# EAGLE design iBuff_Gimp (EAGLE 9.6.2)
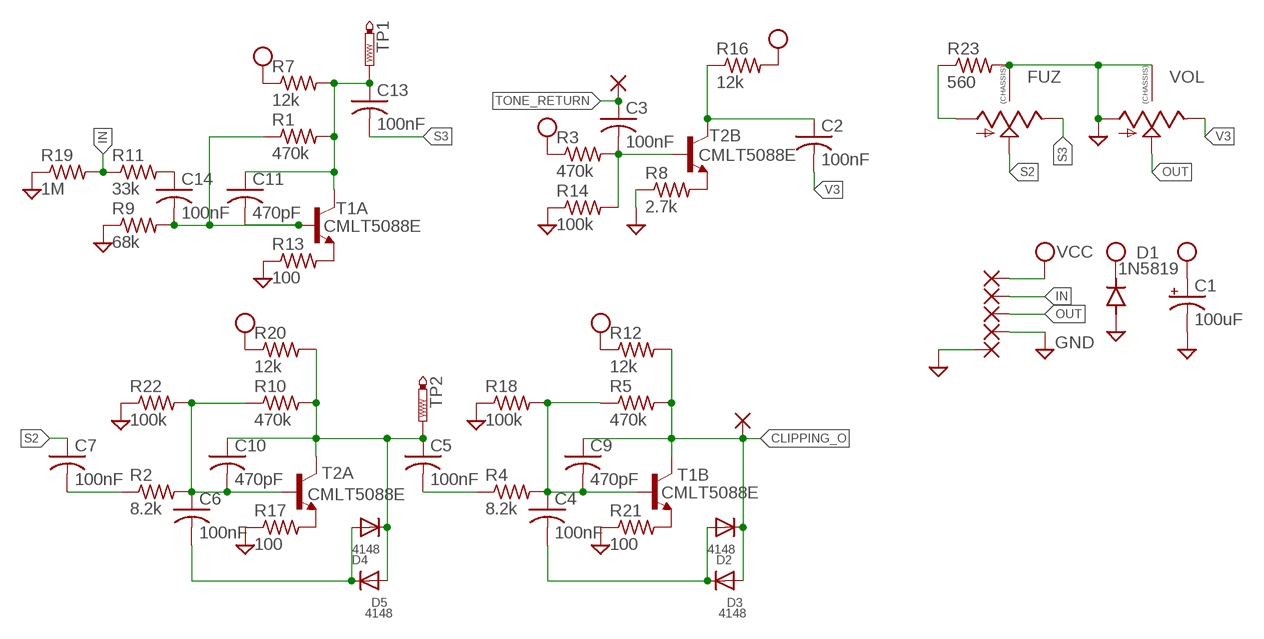
[diagram p0: schematic, sheet 1]

## Parts
C1  100uF  100UF-POLAR-RADIAL-2.5MM-25V-20%  [CPOL-RADIAL-2.5MM-6.5MM]
C2  100nF  C-USC0603  [C0603]
C3  100nF  C-USC0603  [C0603]
C4  100nF  C-USC0603  [C0603]
C5  100nF  C-USC0603  [C0603]
C6  100nF  C-USC0603  [C0603]
C7  100nF  C-USC0603  [C0603]
C9  470pF  C-USC0603  [C0603]
C10  470pF  C-USC0603  [C0603]
C11  470pF  C-USC0603  [C0603]
C13  100nF  C-USC0603  [C0603]
C14  100nF  C-USC0603  [C0603]
D1  1N5819  DIODE-SOD123  [SOD123]
D2  4148  DIODESOD-123  [SOD-123]
D3  4148  DIODESOD-123  [SOD-123]
D4  4148  DIODESOD-123  [SOD-123]
D5  4148  DIODESOD-123  [SOD-123]
FUZ  9MM_SNAP-IN_POT_CHASSIS  [9MM_SNAP-IN_POT]
PAD1  1,6/0,8  [1,6/0,8]
PAD2  1,6/0,8  [1,6/0,8]
PAD3  1,6/0,8  [1,6/0,8]
PAD4  1,6/0,8  [1,6/0,8]
PAD5  1,6/0,8  [1,6/0,8]
PAD6  1,6/0,8  [1,6/0,8]
PAD7  1,6/0,8  [1,6/0,8]
R1  470k  R-US_R0603  [R0603]
R2  8.2k  R-US_R0603  [R0603]
R3  470k  R-US_R0603  [R0603]
R4  8.2k  R-US_R0603  [R0603]
R5  470k  R-US_R0603  [R0603]
R7  12k  R-US_R0603  [R0603]
R8  2.7k  R-US_R0603  [R0603]
R9  68k  R-US_R0603  [R0603]
R10  470k  R-US_R0603  [R0603]
R11  33k  R-US_R0603  [R0603]
R12  12k  R-US_R0603  [R0603]
R13  100  R-US_R0603  [R0603]
R14  100k  R-US_R0603  [R0603]
R16  12k  R-US_R0603  [R0603]
R17  100  R-US_R0603  [R0603]
R18  100k  R-US_R0603  [R0603]
R19  1M  R-US_R0603  [R0603]
R20  12k  R-US_R0603  [R0603]
R21  100  R-US_R0603  [R0603]
R22  100k  R-US_R0603  [R0603]
R23  560  R-US_R0603  [R0603]
T1  CMLT5088E  [SOT563]
T2  CMLT5088E  [SOT563]
TP1  PTR1TP08R  [TP08R]
TP2  PTR1TP08R  [TP08R]
VOL  9MM_SNAP-IN_POT_CHASSIS  [9MM_SNAP-IN_POT]

## Nets
CLIPPING_O: C9.1 D2.C D3.A PAD5.1(P) R5.2 R12.2 T1.3(B:C)
GND: C1.2(-) D1.A FUZ.CHASSIS1 FUZ.CHASSIS2 PAD4.1(P) PAD7.1(P) R8.1 R9.1 R13.1 R14.1 R17.1 R18.1 R19.1 R21.1 R22.1 R23.2 VOL.1(A) VOL.CHASSIS1 VOL.CHASSIS2
IN: PAD2.1(P) R11.1 R19.2
N$1: FUZ.1(A) R23.1
N$2: C11.2 C14.2 R1.1 R9.2 T1.2(A:B)
N$3: C14.1 R11.2
N$4: R13.2 T1.1(A:E)
N$5: C11.1 C13.1 R1.2 R7.2 T1.6(A:C) TP1.TP
N$6: C7.2 R2.1
N$7: C6.1 C10.2 R2.2 R10.1 R22.2 T2.2(A:B)
N$8: C5.1 C10.1 D4.C D5.A R10.2 R20.2 T2.6(A:C) TP2.TP
N$9: R17.2 T2.1(A:E)
N$10: C6.2 D4.A D5.C
N$11: C5.2 R4.1
N$12: R21.2 T1.4(B:E)
N$13: C4.1 C9.2 R4.2 R5.1 R18.2 T1.5(B:B)
N$14: C3.2 R3.2 R14.2 T2.5(B:B)
N$15: C4.2 D2.A D3.C
N$16: R8.2 T2.4(B:E)
N$17: C2.1 R16.1 T2.3(B:C)
OUT: PAD3.1(P) VOL.2(S)
S2: C7.1 FUZ.2(S)
S3: C13.2 FUZ.3(E)
TONE_RETURN: C3.1 PAD6.1(P)
V3: C2.2 VOL.3(E)
VCC: C1.1(+) D1.C PAD1.1(P) R3.1 R7.1 R12.1 R16.2 R20.1

## Library data of the parts
C1 = SparkFun-Capacitors:100UF-POLAR: 100µF polarized capacitors A capacitor is a passive two-terminal electrical component used to store electrical energy temporarily in an electric field.; PROD_ID: CAP-08439
C2-C7 C9-C11 C13 C14 = adafruit:C-US: CAPACITOR, American symbol
D1 = diode:DIODE-: DIODE
D2-D5 = adafruit:DIODE: Diode SMADIODE - SMA Surface Mount Package 20V 1A Schottky Diode Digikey: 641-1014-6-ND DO-1N4148 - Through Hole Small Current Diode SOD-123 20V 1 A (.5mV Vf) Schottky Diode - Digikey: MBRX120TPMSCT-ND SOD-323 10V 570mA (.38mV Vf, 3ns) Schottky Diode - Digikey: ZLLS410CT-ND SOD-523 30V 30mA Schottky Diode (RB751S-40TE61) - Digikey: RB751S-40TE61CT-ND SOT23-R/W - SOT23 Package (R = Solder Paste/Reflow Ovens, W = Hand-Soldering) BAT54Film 40V 300mA - Digikey: 497-7162-1-ND
FUZ VOL = MusicThingModular:9MM_SNAP-IN_POT_CHASSIS: 9mm vertical snap-in pot, Alpha / Panasonic style, with a connection to the metal chassis for grounding
PAD1-PAD7 = wirepad:1,6/0,8: THROUGH-HOLE PAD
R1-R5 R7-R14 R16-R23 = adafruit:R-US_: RESISTOR, American symbol
T1 T2 = transistor-neu-to92:CMLT5088E: DUAL NPN/NPN L88 TRANSISTORS ENHANCED SPECIFICATION PICOmini(TM) SURFACE MOUNT Source: CMLT5078%20SERIES.pdf
TP1 TP2 = testpad:PTR1: TEST PIN

## Board
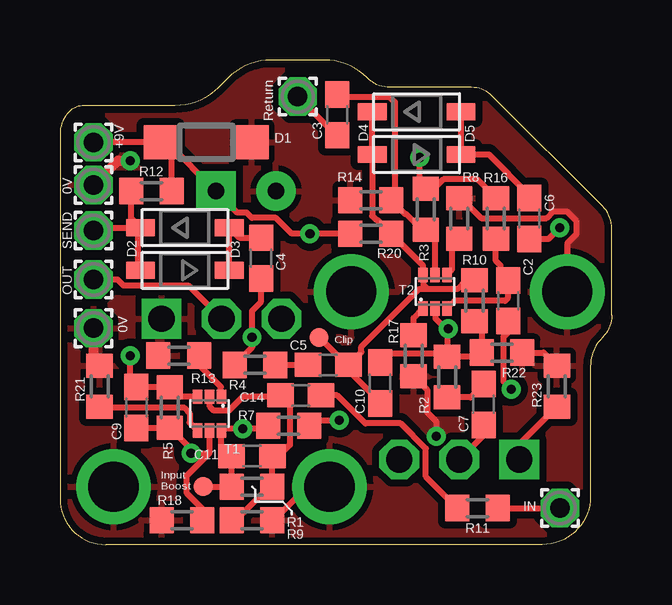
[diagram p1: board, top side]
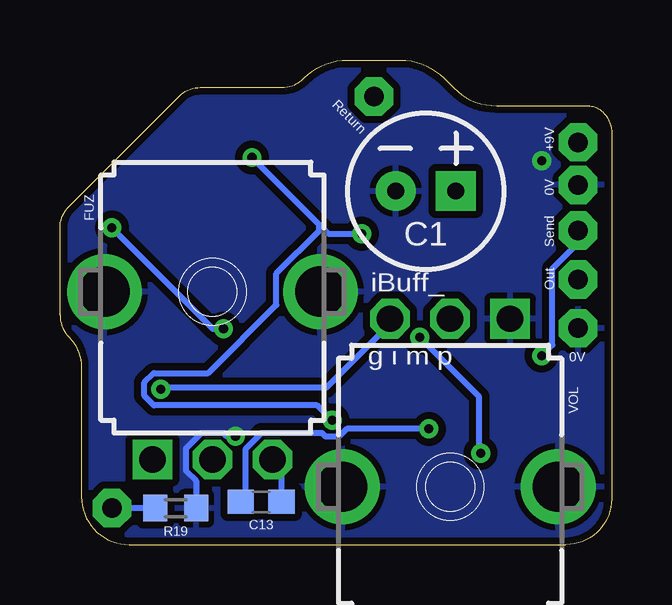
[diagram p2: board, bottom side, seen from below]

Size 22.99 x 20.19 mm. Coordinates in mm from the lower left corner, seen from the top.
Outline: 0,15.75 0,1.91 arc90 1.91,0 20.1,0 arc90 22.1,2 22.1,7.41 arc-45 22.61,8.64 arc45 22.99,9.56 22.99,13.18 arc45 22.61,14.1 18.01,18.69 arc45 17.14,19.05 13.75,19.05 arc-45 12.83,19.43 12.81,19.45 arc45 11.01,20.19 8.8,20.19 arc45 7,19.45 6.59,19.03 arc-45 4.79,18.29 0.99,18.29 arc45 0.38,18.03 arc45 0,17.11 0,15.75
Copper layers (1*16): Top 0.035mm / dielectric 1.5mm / Bottom 0.035mm
Design rules "default *": minimum track width 6mil, minimum drill 0.35mm, track to track 6mil, track to pad 6mil, pad to pad 6mil, via to via 6mil, smd to smd 6mil, copper to edge 10mil, drill to drill 6mil, minimum pad ring 10mil, minimum via ring 8mil, stop-mask expansion 4mil, vias tented up to drill 0mil, thermal gap 10mil

### Footprints (pad centres in the part's own frame; a part is rotated, then mirrored left to right if it is on the bottom)
CPOL-RADIAL-2.5MM-6.5MM = drill 0.7 pad 1.651 square: 1 1.25,0 | drill 0.7 pad 1.651: 2 -1.25,0
C0603 = smd 1.1 x 1: 1 -0.85,0; 2 0.85,0
SOD123 = smd 1.4 x 1.4: A 1.9,0; C -1.9,0
SOD-123 = smd 1.2 x 0.7: A 1.85,0; C -1.85,0
9MM_SNAP-IN_POT = drill 1.1 square: 1 -2.5,-7 | drill 1.1 octagon: 2 0,-7; 3 2.5,-7 | drill 2.1 pad 2.794: CHASSIS1 -4.5,0; CHASSIS2 4.5,0
1,6/0,8 = drill 0.813 pad 1.6 octagon: 1 0,0
R0603 = smd 1 x 1.1: 1 -0.85,0; 2 0.85,0
SOT563 = smd 0.4 x 0.6: 1 -0.5,-0.7; 2 0,-0.7; 3 0.5,-0.7; 4 0.5,0.7; 5 0,0.7; 6 -0.5,0.7
TP08R = smd 0.8 x 0.8: TP 0,0

### Placement (x,y rotation side)
C1  7.75,14.73 0 bottom
C2  18.67,10.16 270 top
C3  11.56,17.91 90 top
C4  8.38,11.94 90 top
C5  11.18,7.49 180 top
C6  19.56,13.59 90 top
C7  17.65,5.84 90 top
C9  3.17,5.71 270 top
C10  13.34,6.73 90 top
C11  8,3.68 0 top
C13  14.61,1.78 0 bottom
C14  10.03,6.22 180 top
D1  6.1,16.76 0 top
D2  5.21,13.21 0 top
D3  5.21,11.43 180 top
D4  14.86,18.03 0 top
D5  14.86,16.26 180 top
FUZ  16.64,10.54 0 bottom
PAD1  1.4,16.76 0 top
PAD2  20.83,1.52 0 top
PAD3  1.4,11.05 0 top
PAD4  1.4,9.02 0 top
PAD5  1.4,13.08 0 top
PAD6  9.91,18.67 0 top
PAD7  1.4,14.99 0 top
R1  8,2.41 180 top
R2  16.13,6.99 90 top
R3  15.24,13.97 270 top
R4  8.13,7.49 180 top
R5  4.57,5.71 90 top
R7  9.53,4.95 180 top
R8  16.64,13.59 270 top
R9  8,1.02 180 top
R10  17.27,10.16 90 top
R11  17.4,1.52 180 top
R12  3.81,14.73 180 top
R13  4.95,7.87 0 top
R14  12.95,14.35 0 top
R16  18.16,13.59 90 top
R17  14.73,7.87 90 top
R18  5.08,1.02 0 top
R19  18.16,1.52 180 bottom
R20  12.95,12.95 0 top
R21  1.65,6.6 270 top
R22  18.41,8 180 top
R23  20.7,6.6 90 top
T1  6.22,5.46 180 top
T2  15.62,10.54 0 top
TP1  5.97,2.41 0 top
TP2  10.79,8.64 0 top
VOL  6.73,2.41 180 bottom

### Tracks (layer width: path | path; a pad name or v marks a point on that pad's centre or on a via)
CLIPPING_O  (via drill 0.38)
  Top 0.254: PAD5.1 1.52,13.21 D2.C 3.27,13.3 | 3.27,13.3 2.96,13.61 R12.2 | D3.A 3.27,11.52 3.27,13.3 | T1.3 4.98,6.16 R5.2 C9.1 2.92,6.82 v2.92,7.87
  Bottom 0.254: v2.92,7.87 2.48,8.32 2.48,11.5 1.4,12.58 PAD5.1
GND  (via drill 0.38)
  Top 0.254: R17.1 15.3,6.46 15.3,5.52 15.67,5.14 v15.67,4.52 | R22.1 20.15,8 R23.2 | R9.1 8.9,1.02 10.3,2.41 VOL.CHASSIS2 | R8.1 16.72,14.44 17.55,13.61 20.28,13.61 20.55,13.88 21.11,13.88 21.5,13.49 21.5,12.93 21.14,12.56 FUZ.CHASSIS1
  Top 0.406: PAD7.1 2.41,16 v2.92,16 | R21.1 1.4,7.71 PAD4.1
  Bottom 0.254: R19.1 17.31,2.65 17.74,3.08 17.74,4 17.09,4.64 16.18,4.64 16.05,4.52 v15.67,4.52
  pour Bottom (isolate 0.305): -2.67,24.13 -2.67,-2.54 25.27,-2.54 25.27,24.13
  pour Top (isolate 0.305): -2.67,24.13 -2.67,-2.54 25.27,-2.54 25.27,24.13
IN
  Top 0.254: R11.1 PAD2.1
  Bottom 0.254: R19.2 PAD2.1
N$1
  Top 0.254: FUZ.1 19.14,4.19 R23.1
N$2
  Top 0.254: R9.2 7.33,1.02 8.72,2.41 R1.1 C11.2 9.1,3.68 9.58,4.16 9.58,5.83 C14.2 9.12,6.16 7.62,6.16 7.04,5.58 6.41,5.58 6.24,5.75 6.24,6.14 T1.2
N$3
  Top 0.254: R11.2 15.24,2.83 15.24,4 14.19,5.05 12.72,5.05 11.55,6.22 C14.1
N$4
  Top 0.254: T1.1 6.7,6.18 6.7,6.58 5.8,7.48 R13.2
N$5  (via drill 0.38)
  Top 0.254: R7.2 8.55,4.83 v7.62,4.83 6.72,4.83 T1.6 6.72,4.11 C11.1 R1.2 TP1.TP
  Bottom 0.254: v7.62,4.83 11.04,4.83 11.36,4.5 11.92,4.5 12.06,4.64 14.59,4.64 15.24,4 15.24,1.99 C13.1
N$6
  Top 0.254: C7.2 17.1,6.13 R2.1
N$7  (via drill 0.38)
  Top 0.254: R2.2 17.4,7.83 R22.2 17.57,9.02 R10.1 | C10.2 13.7,7.95 16.02,7.95 R2.2 | C6.1 20.36,12.74 v20.83,13.21 | T2.2 15.64,9.82 15.64,9.43 16.12,8.94 v16.17,8.99 16.13,8.95 R2.2
  Bottom 0.254: v16.17,8.99 16.61,8.99 v20.83,13.21
N$8
  Top 0.254: 15.3,10.66 15.14,10.82 15.14,11.22 T2.6 15.12,11.64 R20.2 13.24,13.52 13.19,13.52 13.01,13.7 D5.A D4.C | 15.3,10.66 16.56,10.66 16.91,11.01 R10.2 | C5.1 12.03,7.24 13.34,5.93 C10.1 | C5.1 12.56,8.02 12.56,8.25 14.97,10.66 15.3,10.66 | TP2.TP 11.94,7.49 C5.1
N$9
  Top 0.254: R17.2 14.73,9.45 T2.1
N$10
  Top 0.254: D4.A D5.C 17.87,16.26 19.56,14.57 C6.2
N$11
  Top 0.254: R4.1 C5.2
N$12
  Top 0.254: R21.2 1.71,5.69 5.19,5.69 5.4,5.48 5.4,5.08 T1.4
N$13  (via drill 0.38)
  Top 0.254: T1.5 6.22,3.81 | C9.2 R5.1 5.46,3.98 v5.46,3.81 6.22,3.81 | C4.1 8.38,10.13 8,9.74 v8,8.64 8,8.22 R4.2 | R18.2 5.93,1.49 5.29,2.13 5.29,2.88 6.22,3.81
  Bottom 0.254: v5.46,3.81 5.46,3.94 5.53,4 5.53,6.16 v8,8.64
N$14
  Top 0.254: T2.5 15.62,12.74 R3.2 15.08,13.12 14.42,13.78 14.37,13.78 13.95,14.2 | R14.2 13.95,14.2 | C3.2 11.65,18.66 13.72,18.66 13.95,18.44 13.95,14.2
N$15
  Top 0.254: D3.C D2.A 7.48,12.79 C4.2
N$16
  Top 0.254: T2.4 16.32,11.44 16.32,12.42 R8.2
N$17
  Top 0.254: R16.1 18.16,11.82 18.36,11.63 18.36,11.32 C2.1 18.67,10.29 18.54,10.16 16.44,10.16 T2.3
OUT
  Top 0.254: PAD3.1 2.39,11.05 2.64,10.8 5.34,10.8 VOL.2
S2
  Top 0.254: C7.1 17.65,4.56 FUZ.2
S3
  Bottom 0.254: C13.2 13.76,3.16 FUZ.3
TONE_RETURN
  Top 0.254: C3.1 11.52,17.06 PAD6.1
V3  (via drill 0.38)
  Top 0.254: C2.2 18.67,8.85 18.49,8.67 18.49,6.79 v18.8,6.48
  Bottom 0.254: v18.8,6.48 18.73,6.54 11.88,6.54 9.23,9.2 VOL.3
VCC  (via drill 0.38)
  Top 0.254: D1.C 4.46,16.76 C1.1 7.39,13.84 7.77,13.84 7.99,13.62 9,13.62 9.66,12.95 v10.41,12.95 R20.1 | R12.1 4.66,16.3 D1.C | D1.C PAD1.1 | R16.2 17.38,15.22 15.97,15.22 15.57,14.82 R3.1 14.99,15.07 v14.99,16.13 | R7.1 10.6,5.18 v11.64,5.18
  Bottom 0.254: v14.99,16.13 12.19,13.34 | 12.19,13.34 11.81,12.95 v10.41,12.95 | 12.19,13.34 12.19,13.08 13.97,11.3 13.97,9.99 16.81,7.15 19.07,7.15 19.47,6.76 19.47,6.2 19.07,5.8 12.27,5.8 v11.64,5.18

### Text on the board
tPlace: Return | +9V | 0V | SEND | OUT | 0V | Clip | Input / Boost | IN
bPlace: Return | +9V | 0V | Send | Out | iBuff_ | 0V | g i m p